# Altium schematic sheet 004_USB.SchDoc: =title_line_1 + title_line_2
size 594 x 420 mm; SheetNumber: 4
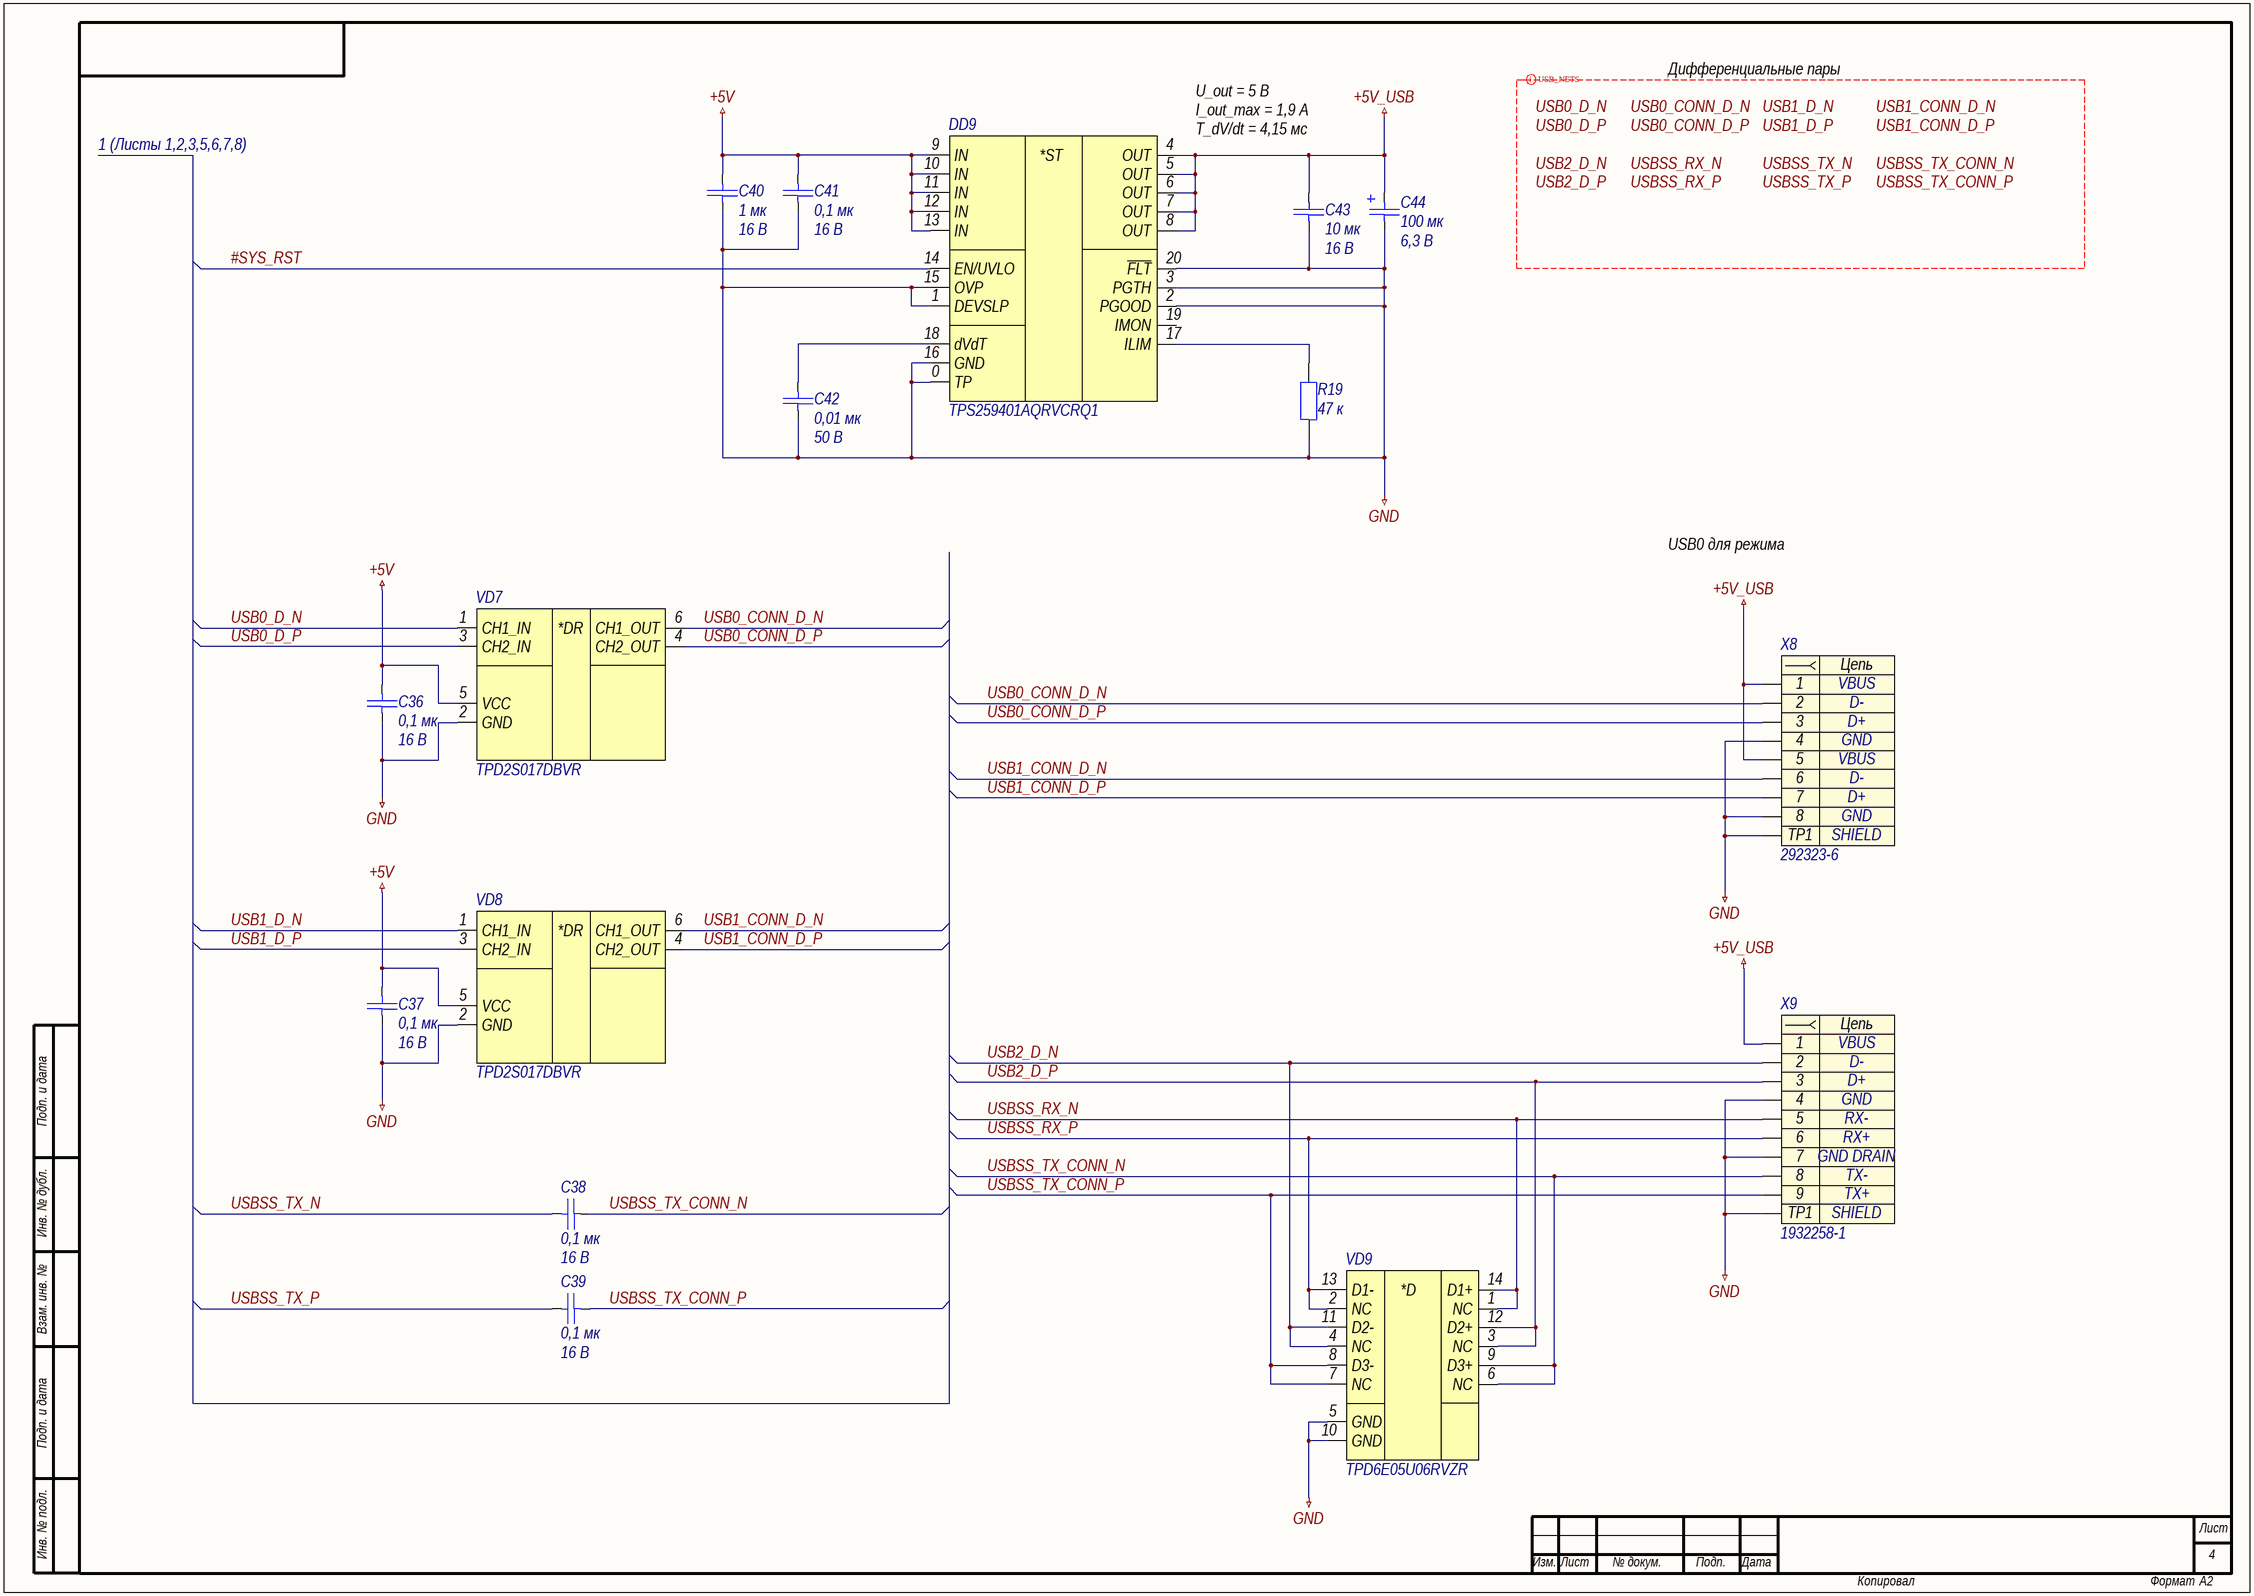
[diagram p0: 004_USB.SchDoc]

## Parts
C36  0,1 мк  Напряжение: 16 В  [C0603]
C37  0,1 мк  Напряжение: 16 В  [C0603]
C38  0,1 мк  Напряжение: 16 В  [C0603]
C39  0,1 мк  Напряжение: 16 В  [C0603]
C40  1 мк  Напряжение: 16 В  [C0603]
C41  0,1 мк  Напряжение: 16 В  [C0603]
C42  0,01 мк  Напряжение: 50 В  [C0603]
C43  10 мк  Напряжение: 16 В  [C0603]
C44  100 мк  Напряжение: 6,3 В  [C7343-20]
DD9  TPS259401AQRVCRQ1  [WQFN-20-P50-300X400X80-L40X20-T270X170]
R19  47 к  [R0603]
VD7  TPD2S017DBVR  [SOT-23-6-P95-290X280X145]
VD8  TPD2S017DBVR  [SOT-23-6-P95-290X280X145]
VD9  TPD6E05U06RVZR  [USON-14-P50-350X135X55-L30X20]
X8  292323-6  [292323-6]
X9  1932258-1  [1932258-1]

## Nets
+5V: C36.1 C37.1 C40.1 C41.1 DD9.9(IN) DD9.10(IN) DD9.11(IN) DD9.12(IN) DD9.13(IN) VD7.5(VCC) VD8.5(VCC)
+5V_USB: C43.1 C44.1 DD9.4(OUT) DD9.5(OUT) DD9.6(OUT) DD9.7(OUT) DD9.8(OUT) X8.1 X8.5 X9.1
GND: C36.2 C37.2 C40.2 C41.2 C42.2 C43.2 C44.2 DD9.0(TP) DD9.1(DEVSLP) DD9.2(PGOOD) DD9.3(PGTH) DD9.15(OVP) DD9.16(GND) DD9.20(~{FLT}) R19.1 VD7.2(GND) VD8.2(GND) VD9.5(GND) VD9.10(GND) X8.4 X8.8 X8.TP1 X9.4 X9.7 X9.TP1
#SYS_RST: DD9.14(EN/UVLO)
USB0_CONN_D_N: VD7.6(CH1_OUT) X8.2
USB0_CONN_D_P: VD7.4(CH2_OUT) X8.3
USB0_D_N: VD7.1(CH1_IN)
USB0_D_P: VD7.3(CH2_IN)
USB1_CONN_D_N: VD8.6(CH1_OUT) X8.6
USB1_CONN_D_P: VD8.4(CH2_OUT) X8.7
USB1_D_N: VD8.1(CH1_IN)
USB1_D_P: VD8.3(CH2_IN)
USB2_D_N: VD9.4(NC) VD9.11(D2-) X9.2
USB2_D_P: VD9.3(NC) VD9.12(D2+) X9.3
USBSS_RX_N: VD9.1(NC) VD9.14(D1+) X9.5
USBSS_RX_P: VD9.2(NC) VD9.13(D1-) X9.6
USBSS_TX_CONN_N: C38.2 VD9.6(NC) VD9.9(D3+) X9.8
USBSS_TX_CONN_P: C39.2 VD9.7(NC) VD9.8(D3-) X9.9
USBSS_TX_N: C38.1
USBSS_TX_P: C39.1
NetC42_1: C42.1 DD9.18(dVdT)
NetDD9_17: DD9.17(ILIM) R19.2

Not connected (* = marked no-connect by the designer): DD9 19(IMON)

## Layout directives
differential pair; rule Differential Pairs Routing [Pref Gap = 0.3mm    Min Gap  = 0.15mm    Max Gap  = 0.3mmPref Width = 0.126mm    Min Width  = 0.126mm    Max Width  = 0.155mm]; differential pair class USB_SIGNALS: USB0_CONN_D_N, USB0_CONN_D_P, USB0_D_N, USB0_D_P, USB1_CONN_D_N, USB1_CONN_D_P, USB1_D_N, USB1_D_P, USB2_D_N, USB2_D_P, USBSS_RX_N, USBSS_RX_P, USBSS_TX_CONN_N, USBSS_TX_CONN_P, USBSS_TX_N, USBSS_TX_P

## Notes on the sheet
- Дифференциальные пары
- 1 (Листы 1,2,3,5,6,7,8)
- U_out = 5 В
  I_out_max = 1,9 А
  T_dV/dt = 4,15 мс
- USB0 для режима восстановления
- Labels drawn without touching a wire or pin: USB0_CONN_D_N, USB0_CONN_D_P, USB0_D_N, USB0_D_P, USB1_CONN_D_N, USB1_CONN_D_P, USB1_D_N, USB1_D_P, USB2_D_N, USB2_D_P, USBSS_RX_N, USBSS_RX_P, USBSS_TX_CONN_N, USBSS_TX_CONN_P, USBSS_TX_N, USBSS_TX_P
- Подп. и дата
- Инв. № дубл.
- Взам. инв. №
- Инв. № подл.
- Лист
- Изм.
- № докум.
- Подп.
- Дата
- Копировал
- Формат
- А2
- (in symbol dd0004) *ST
- (in symbol vd0016) *DR
- (in symbol vd0018) *D
- (in symbol x0004) Цепь
- (in symbol x0005) Цепь

## Library data of the parts
C36-C39 C41 = c0081: =Описание; ID: c0081; Фамилия: Паньков; Описание: Конденсатор керамический чип 0603 100 нФ 16 В ±10 %; Наименование: CC0603KRX7R7BB104; Производитель: YAGEO Corp.; Отклонение: ±10 %; Рабочие температуры: от –55 °С до +125 °С; Температурный коэффициент емкости: X7R; Корпус: 0603; Номинал: 0,1 мк; Номинальное напряжение: 16 В; HelpURL: https://www.yageo.com/upload/media/product/productsearch/datasheet/mlcc/UPY-GPHC_X7R_6.3V-to-50V_20.pdf
C40 = c0113: =Описание; ID: c0113; Фамилия: Паньков; Описание: Конденсатор керамический чип 0603 1 мкФ 16 В ±10 %; Наименование: CC0603KRX7R7BB105; Производитель: YAGEO Corp.; Отклонение: ±10 %; Рабочие температуры: от –55 °С до +125 °С; Температурный коэффициент емкости: X7R; Корпус: 0603; Номинал: 1 мк; Номинальное напряжение: 16 В; HelpURL: https://www.yageo.com/upload/media/product/productsearch/datasheet/mlcc/UPY-GPHC_X7R_6.3V-to-50V_20.pdf
C42 = c0056: =Описание; ID: c0056; Фамилия: Паньков; Описание: Конденсатор керамический чип 0603 10 нФ 50 В ±10 %; Наименование: CC0603KRX7R9BB103; Производитель: YAGEO Corp.; Отклонение: ±10 %; Рабочие температуры: от –55 °С до +125 °С; Температурный коэффициент емкости: X7R; Корпус: 0603; Номинал: 0,01 мк; Номинальное напряжение: 50 В; HelpURL: https://www.yageo.com/upload/media/product/productsearch/datasheet/mlcc/UPY-GPHC_X7R_6.3V-to-50V_20.pdf
C43 = c0145: =Описание; ID: c0145; Фамилия: Паньков; Описание: Конденсатор керамический чип 0603 10 мкФ 16 В ±10 %; Наименование: CC0603KRX5R7BB106; Производитель: YAGEO Corp.; Отклонение: ±10 %; Рабочие температуры: от –55 °С до +85 °С; Температурный коэффициент емкости: X5R; Корпус: 0603; Номинал: 10 мк; Номинальное напряжение: 16 В; HelpURL: https://www.yageo.com/upload/media/product/productsearch/datasheet/mlcc/UPY-GPHC_X5R_4V-to-50V_26.pdf
C44 = c0170: =Описание; ID: c0170; Фамилия: Ларионов; Описание: Конденсатор электролитический чип 7343-20 100 мкФ 6,3 В ±20 %; Наименование: ECASD40J107M015K00; Производитель: Murata Manufacturing Co., Ltd.; Отклонение: ±20 %; Эквивалентное последовательное сопротивление: 0,015 Ом; Среднеквадратичный размах пульсации тока: 2 А; Рабочие температуры: от –40 °С до +105 °С; Корпус: 7343-20; Номинал: 100 мк; Номинальное напряжение: 6,3 В; HelpURL: https://www.murata.com/en-us/products/productdetail?partno=ECASD40J107M015K00
DD9 = dd0004: =Описание; ID: dd0004; Фамилия: Ларионов; Описание: Защитная микросхема eFuse 18 В и 5,3 А; Производитель: Texas Instruments Inc.; Напряжение: от 2,7 В до 18 В; Максимальное напряжение: 20 В; Ток: от 0,6 А до 5,3 А; Рабочие температуры: от –40 °С до +125 °С; Корпус: WQFN-20; Наименование: TPS259401AQRVCRQ1; HelpURL: https://www.ti.com/product/TPS25940-Q1
R19 = r0129: =Описание; ID: r0129; Фамилия: Паньков; Описание: Резистор чип 0603 47 кОм ±1 % 0,1 Вт; Наименование: RC0603FR-0747KL; Производитель: YAGEO Corp.; Отклонение: ±1 %; Номинальное напряжение: 75 В; Номинальный ток: 1 А; Рабочие температуры: от –55 °С до +155 °С; Корпус: 0603; Примечание: Ряд E24; Номинал: 47 к; HelpURL: https://www.yageo.com/upload/media/product/productsearch/datasheet/rchip/PYu-RC_Group_51_RoHS_L_11.pdf
VD7 VD8 = vd0016: =Описание; ID: vd0016; Фамилия: Паньков; Описание: Диодная сборка для подавления помех 5 В; Производитель: Texas Instruments Inc.; Корпус: SOT-23-6; Наименование: TPD2S017DBVR; HelpURL: https://www.ti.com/product/TPD2S017
VD9 = vd0018: =Описание; ID: vd0018; Фамилия: Ларионов; Описание: Диодная сборка для подавления помех 5,5 В; Производитель: Texas Instruments Inc.; Корпус: USON-14; Наименование: TPD6E05U06RVZR; HelpURL: https://www.ti.com/product/TPD6E05U06
X8 = x0004: =Описание; Contact_1: VBUS; Contact_2: D-; Contact_3: D+; Contact_4: GND; TP1: SHIELD; ID: x0004; Фамилия: Ларионов; Описание: USB 2.0 Type A x2 гнездо угловой; Производитель: TE Connectivity; Contact_5: VBUS; Contact_6: D-; Contact_7: D+; Contact_8: GND; Наименование: 292323-6; HelpURL: https://www.te.com/usa-en/product-292323-6.html
X9 = x0005: =Описание; Contact_1: VBUS; Contact_2: D-; Contact_3: D+; Contact_4: GND; Contact_5: RX-; Contact_6: RX+; Contact_7: GND DRAIN; Contact_8: TX-; Contact_9: TX+; TP1: SHIELD; ID: x0005; Фамилия: Ларионов; Описание: USB 3.0 Type A гнездо угловой; Производитель: TE Connectivity; Наименование: 1932258-1; HelpURL: https://www.te.com/usa-en/product-1932258-1.html